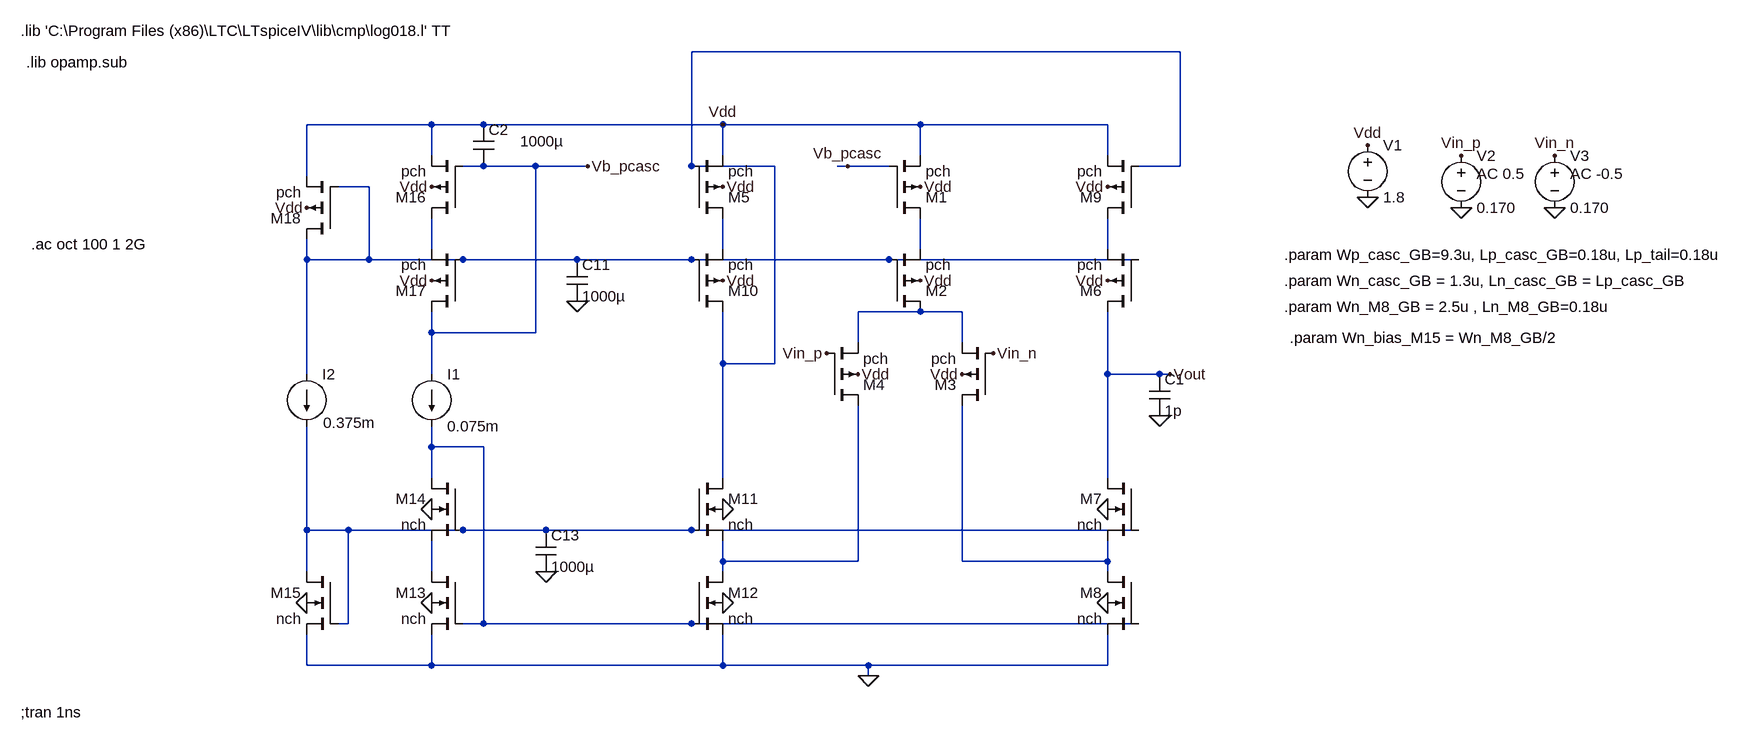
[diagram p0: schematic GB-PMOS.asc]
GB-PMOS.asc, the LTspice schematic file:
Version 4
SHEET 1 3836 784
WIRE 1584 -992 832 -992
WIRE 432 -880 240 -880
WIRE 512 -880 432 -880
WIRE 880 -880 512 -880
WIRE 1184 -880 880 -880
WIRE 1376 -880 1184 -880
WIRE 1472 -880 1376 -880
WIRE 432 -832 432 -880
WIRE 880 -832 880 -880
WIRE 1184 -832 1184 -880
WIRE 1472 -832 1472 -880
WIRE 512 -816 480 -816
WIRE 560 -816 512 -816
WIRE 592 -816 560 -816
WIRE 672 -816 592 -816
WIRE 832 -816 832 -992
WIRE 960 -816 832 -816
WIRE 1072 -816 1056 -816
WIRE 1136 -816 1072 -816
WIRE 1584 -816 1584 -992
WIRE 1584 -816 1520 -816
WIRE 240 -800 240 -880
WIRE 336 -784 288 -784
WIRE 880 -720 880 -736
WIRE 1184 -704 1184 -736
WIRE 1472 -704 1472 -736
WIRE 432 -688 432 -736
WIRE 880 -688 880 -720
WIRE 1184 -688 1184 -704
WIRE 1472 -688 1472 -704
WIRE 240 -672 240 -704
WIRE 336 -672 336 -784
WIRE 336 -672 240 -672
WIRE 480 -672 336 -672
WIRE 528 -672 480 -672
WIRE 656 -672 528 -672
WIRE 832 -672 656 -672
WIRE 1136 -672 832 -672
WIRE 1520 -672 1136 -672
WIRE 1184 -592 1088 -592
WIRE 1232 -592 1184 -592
WIRE 1248 -592 1232 -592
WIRE 432 -560 432 -592
WIRE 592 -560 592 -816
WIRE 592 -560 432 -560
WIRE 1472 -560 1472 -592
WIRE 880 -544 880 -592
WIRE 1088 -544 1088 -592
WIRE 1248 -544 1248 -592
WIRE 880 -512 880 -544
WIRE 960 -512 960 -816
WIRE 960 -512 880 -512
WIRE 240 -496 240 -672
WIRE 432 -496 432 -560
WIRE 1472 -496 1472 -560
WIRE 1552 -496 1472 -496
WIRE 1568 -496 1552 -496
WIRE 1088 -400 1088 -448
WIRE 1248 -400 1248 -448
WIRE 432 -384 432 -416
WIRE 512 -384 432 -384
WIRE 880 -384 880 -512
WIRE 1472 -384 1472 -496
WIRE 432 -336 432 -384
WIRE 880 -336 880 -384
WIRE 1472 -336 1472 -384
WIRE 240 -256 240 -416
WIRE 304 -256 240 -256
WIRE 480 -256 304 -256
WIRE 608 -256 480 -256
WIRE 752 -256 608 -256
WIRE 832 -256 752 -256
WIRE 1520 -256 832 -256
WIRE 880 -208 880 -240
WIRE 960 -208 880 -208
WIRE 1088 -208 1088 -400
WIRE 1088 -208 960 -208
WIRE 1248 -208 1248 -400
WIRE 1392 -208 1248 -208
WIRE 1472 -208 1472 -240
WIRE 1472 -208 1392 -208
WIRE 240 -192 240 -256
WIRE 432 -192 432 -240
WIRE 880 -192 880 -208
WIRE 1472 -192 1472 -208
WIRE 304 -112 304 -256
WIRE 304 -112 288 -112
WIRE 512 -112 512 -384
WIRE 512 -112 480 -112
WIRE 640 -112 512 -112
WIRE 832 -112 640 -112
WIRE 1168 -112 832 -112
WIRE 1520 -112 1168 -112
WIRE 240 -48 240 -96
WIRE 432 -48 432 -96
WIRE 432 -48 240 -48
WIRE 880 -48 880 -96
WIRE 880 -48 432 -48
WIRE 1104 -48 880 -48
WIRE 1472 -48 1472 -96
WIRE 1472 -48 1104 -48
WIRE 1104 -32 1104 -48
FLAG 880 -288 0
FLAG 880 -144 0
FLAG 880 -880 Vdd
FLAG 880 -640 Vdd
FLAG 880 -784 Vdd
FLAG 432 -144 0
FLAG 240 -144 0
FLAG 432 -288 0
FLAG 432 -784 Vdd
FLAG 432 -640 Vdd
FLAG 240 -752 Vdd
FLAG 1472 -288 0
FLAG 1472 -144 0
FLAG 1472 -640 Vdd
FLAG 1472 -784 Vdd
FLAG 1104 -32 0
FLAG 656 -608 0
FLAG 608 -192 0
FLAG 1568 -496 Vout
FLAG 1552 -432 0
FLAG 1872 -848 Vdd
FLAG 1872 -768 0
FLAG 2016 -752 0
FLAG 2160 -752 0
FLAG 2016 -832 Vin_p
FLAG 2160 -832 Vin_n
FLAG 1184 -640 Vdd
FLAG 1184 -784 Vdd
FLAG 1088 -496 Vdd
FLAG 1248 -496 Vdd
FLAG 1040 -528 Vin_p
FLAG 1296 -528 Vin_n
FLAG 672 -816 Vb_pcasc
FLAG 1072 -816 Vb_pcasc
DATAFLAG 960 -208 "round($*10k)/10k"
DATAFLAG 880 -544 "round($*1k)/1k"
DATAFLAG 1392 -208 "round($*10k)/10k"
DATAFLAG 1376 -880 "round($*1k)/1k"
DATAFLAG 1472 -560 "round($*1k)/1k"
DATAFLAG 880 -384 "round(Id(M11)*10000000)/10000000"
DATAFLAG 960 -816 "-Id(M5)"
DATAFLAG 1168 -112 ""
DATAFLAG 1088 -400 "round(-Id(M4)*10000000)/10000000"
DATAFLAG 1248 -400 "round(-Id(M3)*10000000)/10000000"
DATAFLAG 1472 -384 "round(Id(M7)*10000000)/10000000"
DATAFLAG 880 -720 "round($*1000)/1000"
DATAFLAG 1184 -704 "round($*1000)/1000"
DATAFLAG 1472 -704 "round($*1000)/1000"
DATAFLAG 752 -256 "round($*1k)/1k"
DATAFLAG 640 -112 "round($*1k)/1k"
DATAFLAG 528 -672 "round($*1k)/1k"
DATAFLAG 560 -816 "round($*1k)/1k"
DATAFLAG 1232 -592 "round($*1k)/1k"
SYMBOL pmos4 832 -592 M180
SYMATTR InstName M10
SYMATTR Value pch
SYMATTR Value2 l={Lp_casc_GB} w={Wp_casc_GB}
SYMBOL nmos4 832 -336 R0
SYMATTR InstName M11
SYMATTR Value nch
SYMATTR Value2 l={Ln_casc_GB} w={Wn_casc_GB}
SYMBOL nmos4 832 -192 R0
SYMATTR InstName M12
SYMATTR Value nch
SYMATTR Value2 l={Ln_casc_GB} w={Wn_M8_GB}
SYMBOL pmos4 832 -736 M180
SYMATTR InstName M5
SYMATTR Value pch
SYMATTR Value2 l={Lp_casc_GB} w={Wp_casc_GB}
SYMBOL nmos4 480 -192 M0
SYMATTR InstName M13
SYMATTR Value nch
SYMATTR Value2 l={Ln_casc_GB} w={Wn_M8_GB}
SYMBOL current 432 -496 R0
WINDOW 123 0 0 Left 2
WINDOW 39 0 0 Left 2
SYMATTR InstName I1
SYMATTR Value 0.075m
SYMBOL nmos4 480 -336 M0
SYMATTR InstName M14
SYMATTR Value nch
SYMATTR Value2 l={Ln_casc_GB} w={Wn_casc_GB}
SYMBOL current 240 -496 R0
WINDOW 123 0 0 Left 2
WINDOW 39 0 0 Left 2
WINDOW 3 25 75 Left 2
SYMATTR Value 0.375m
SYMATTR InstName I2
SYMBOL nmos4 288 -192 M0
SYMATTR InstName M15
SYMATTR Value nch
SYMATTR Value2 l={Ln_M8_GB} w={Wn_casc_GB}
SYMBOL pmos4 480 -736 R180
SYMATTR InstName M16
SYMATTR Value pch
SYMATTR Value2 l={Lp_casc_GB} w={Wp_casc_GB}
SYMBOL pmos4 480 -592 R180
SYMATTR InstName M17
SYMATTR Value pch
SYMATTR Value2 l={Lp_casc_GB} w={Wp_casc_GB}
SYMBOL pmos4 288 -704 R180
SYMATTR InstName M18
SYMATTR Value pch
SYMATTR Value2 l={Lp_casc_GB} w={Wp_casc_GB}
SYMBOL pmos4 1520 -592 R180
SYMATTR InstName M6
SYMATTR Value pch
SYMATTR Value2 l={Lp_casc_GB} w={Wp_casc_GB}
SYMBOL nmos4 1520 -336 M0
SYMATTR InstName M7
SYMATTR Value nch
SYMATTR Value2 l={Ln_casc_GB} w={Wn_casc_GB}
SYMBOL nmos4 1520 -192 M0
SYMATTR InstName M8
SYMATTR Value nch
SYMATTR Value2 l={Ln_casc_GB} w={Wn_M8_GB}
SYMBOL pmos4 1520 -736 R180
SYMATTR InstName M9
SYMATTR Value pch
SYMATTR Value2 l={Lp_casc_GB} w={Wp_casc_GB}
SYMBOL cap 640 -672 R0
SYMATTR InstName C11
SYMATTR Value 1000µ
SYMBOL cap 592 -256 R0
SYMATTR InstName C13
SYMATTR Value 1000µ
SYMBOL cap 1536 -496 R0
SYMATTR InstName C1
SYMATTR Value 1p
SYMBOL Overige\ componenten\\voltage 1872 -864 R0
WINDOW 123 0 0 Left 2
WINDOW 39 0 0 Left 2
SYMATTR InstName V1
SYMATTR Value 1.8
SYMBOL Overige\ componenten\\voltage 2016 -848 R0
WINDOW 123 24 44 Left 2
WINDOW 39 0 0 Left 2
SYMATTR Value2 AC 0.5
SYMATTR InstName V2
SYMATTR Value 0.170
SYMBOL Overige\ componenten\\voltage 2160 -848 R0
WINDOW 123 24 44 Left 2
WINDOW 39 0 0 Left 2
SYMATTR Value2 AC -0.5
SYMATTR InstName V3
SYMATTR Value 0.170
SYMBOL pmos4 1136 -736 M180
SYMATTR InstName M1
SYMATTR Value pch
SYMATTR Value2 l={Lp_casc_GB} w={Wp_casc_GB}
SYMBOL pmos4 1136 -592 M180
SYMATTR InstName M2
SYMATTR Value pch
SYMATTR Value2 l={Lp_tail} w={Wp_casc_GB}
SYMBOL pmos4 1296 -448 R180
SYMATTR InstName M3
SYMATTR Value pch
SYMATTR Value2 l=0.18u w=16u m=2
SYMBOL pmos4 1040 -448 M180
SYMATTR InstName M4
SYMATTR Value pch
SYMATTR Value2 l=0.18u w=16u m=2
SYMBOL cap 496 -880 R0
WINDOW 3 72 26 Left 2
SYMATTR InstName C2
SYMATTR Value 1000µ
TEXT -200 -1024 Left 2 !.lib 'C:\\Program Files (x86)\\LTC\\LTspiceIV\\lib\\cmp\\log018.l' TT
TEXT -192 -976 Left 2 !.lib opamp.sub
TEXT -200 24 Left 2 !;tran 1ns
TEXT 1744 -680 Left 2 !.param Wp_casc_GB=9.3u, Lp_casc_GB=0.18u, Lp_tail=0.18u
TEXT 1744 -640 Left 2 !.param Wn_casc_GB = 1.3u, Ln_casc_GB = Lp_casc_GB
TEXT 1744 -600 Left 2 !.param Wn_M8_GB = 2.5u , Ln_M8_GB=0.18u
TEXT -184 -696 Left 2 !.ac oct 100 1 2G
TEXT 1752 -552 Left 2 !.param Wn_bias_M15 = Wn_M8_GB/2

The netlist it stands for:
* GB-PMOS.asc
M10 N001 N002 N003 Vdd pch l={Lp_casc_GB} w={Wp_casc_GB}
M11 N001 N011 N008 0 nch l={Ln_casc_GB} w={Wn_casc_GB}
M12 N008 N010 0 0 nch l={Ln_casc_GB} w={Wn_M8_GB}
M5 N003 N001 Vdd Vdd pch l={Lp_casc_GB} w={Wp_casc_GB}
M13 N012 N010 0 0 nch l={Ln_casc_GB} w={Wn_M8_GB}
I1 Vb_pcasc N010 0.075m
M14 N010 N011 N012 0 nch l={Ln_casc_GB} w={Wn_casc_GB}
I2 N002 N011 0.375m
M15 N011 N011 0 0 nch l={Ln_M8_GB} w={Wn_casc_GB}
M16 N006 Vb_pcasc Vdd Vdd pch l={Lp_casc_GB} w={Wp_casc_GB}
M17 Vb_pcasc N002 N006 Vdd pch l={Lp_casc_GB} w={Wp_casc_GB}
M18 N002 N002 Vdd Vdd pch l={Lp_casc_GB} w={Wp_casc_GB}
M6 Vout N002 N005 Vdd pch l={Lp_casc_GB} w={Wp_casc_GB}
M7 Vout N011 N009 0 nch l={Ln_casc_GB} w={Wn_casc_GB}
M8 N009 N010 0 0 nch l={Ln_casc_GB} w={Wn_M8_GB}
M9 N005 N001 Vdd Vdd pch l={Lp_casc_GB} w={Wp_casc_GB}
C11 N002 0 1000µ
C13 N011 0 1000µ
C1 Vout 0 1p
V1 Vdd 0 1.8
V2 Vin_p 0 0.170 AC 0.5
V3 Vin_n 0 0.170 AC -0.5
M1 N004 Vb_pcasc Vdd Vdd pch l={Lp_casc_GB} w={Wp_casc_GB}
M2 N007 N002 N004 Vdd pch l={Lp_tail} w={Wp_casc_GB}
M3 N009 Vin_n N007 Vdd pch l=0.18u w=16u m=2
M4 N008 Vin_p N007 Vdd pch l=0.18u w=16u m=2
C2 Vdd Vb_pcasc 1000µ
.model NMOS NMOS
.model PMOS PMOS
.lib standard.mos
.lib 'C:\Program Files (x86)\LTC\LTspiceIV\lib\cmp\log018.l' TT
.lib opamp.sub
;tran 1ns
.param Wp_casc_GB=9.3u, Lp_casc_GB=0.18u, Lp_tail=0.18u
.param Wn_casc_GB = 1.3u, Ln_casc_GB = Lp_casc_GB
.param Wn_M8_GB = 2.5u , Ln_M8_GB=0.18u
.ac oct 100 1 2G
.param Wn_bias_M15 = Wn_M8_GB/2
.backanno
.end